# EAGLE design lamloei_breadout_a09201 (EAGLE 7.7.0)
CNAME: LamLoei breadout A07201; CREVISION: R1; DESIGNER: lamloei co.,ltd.
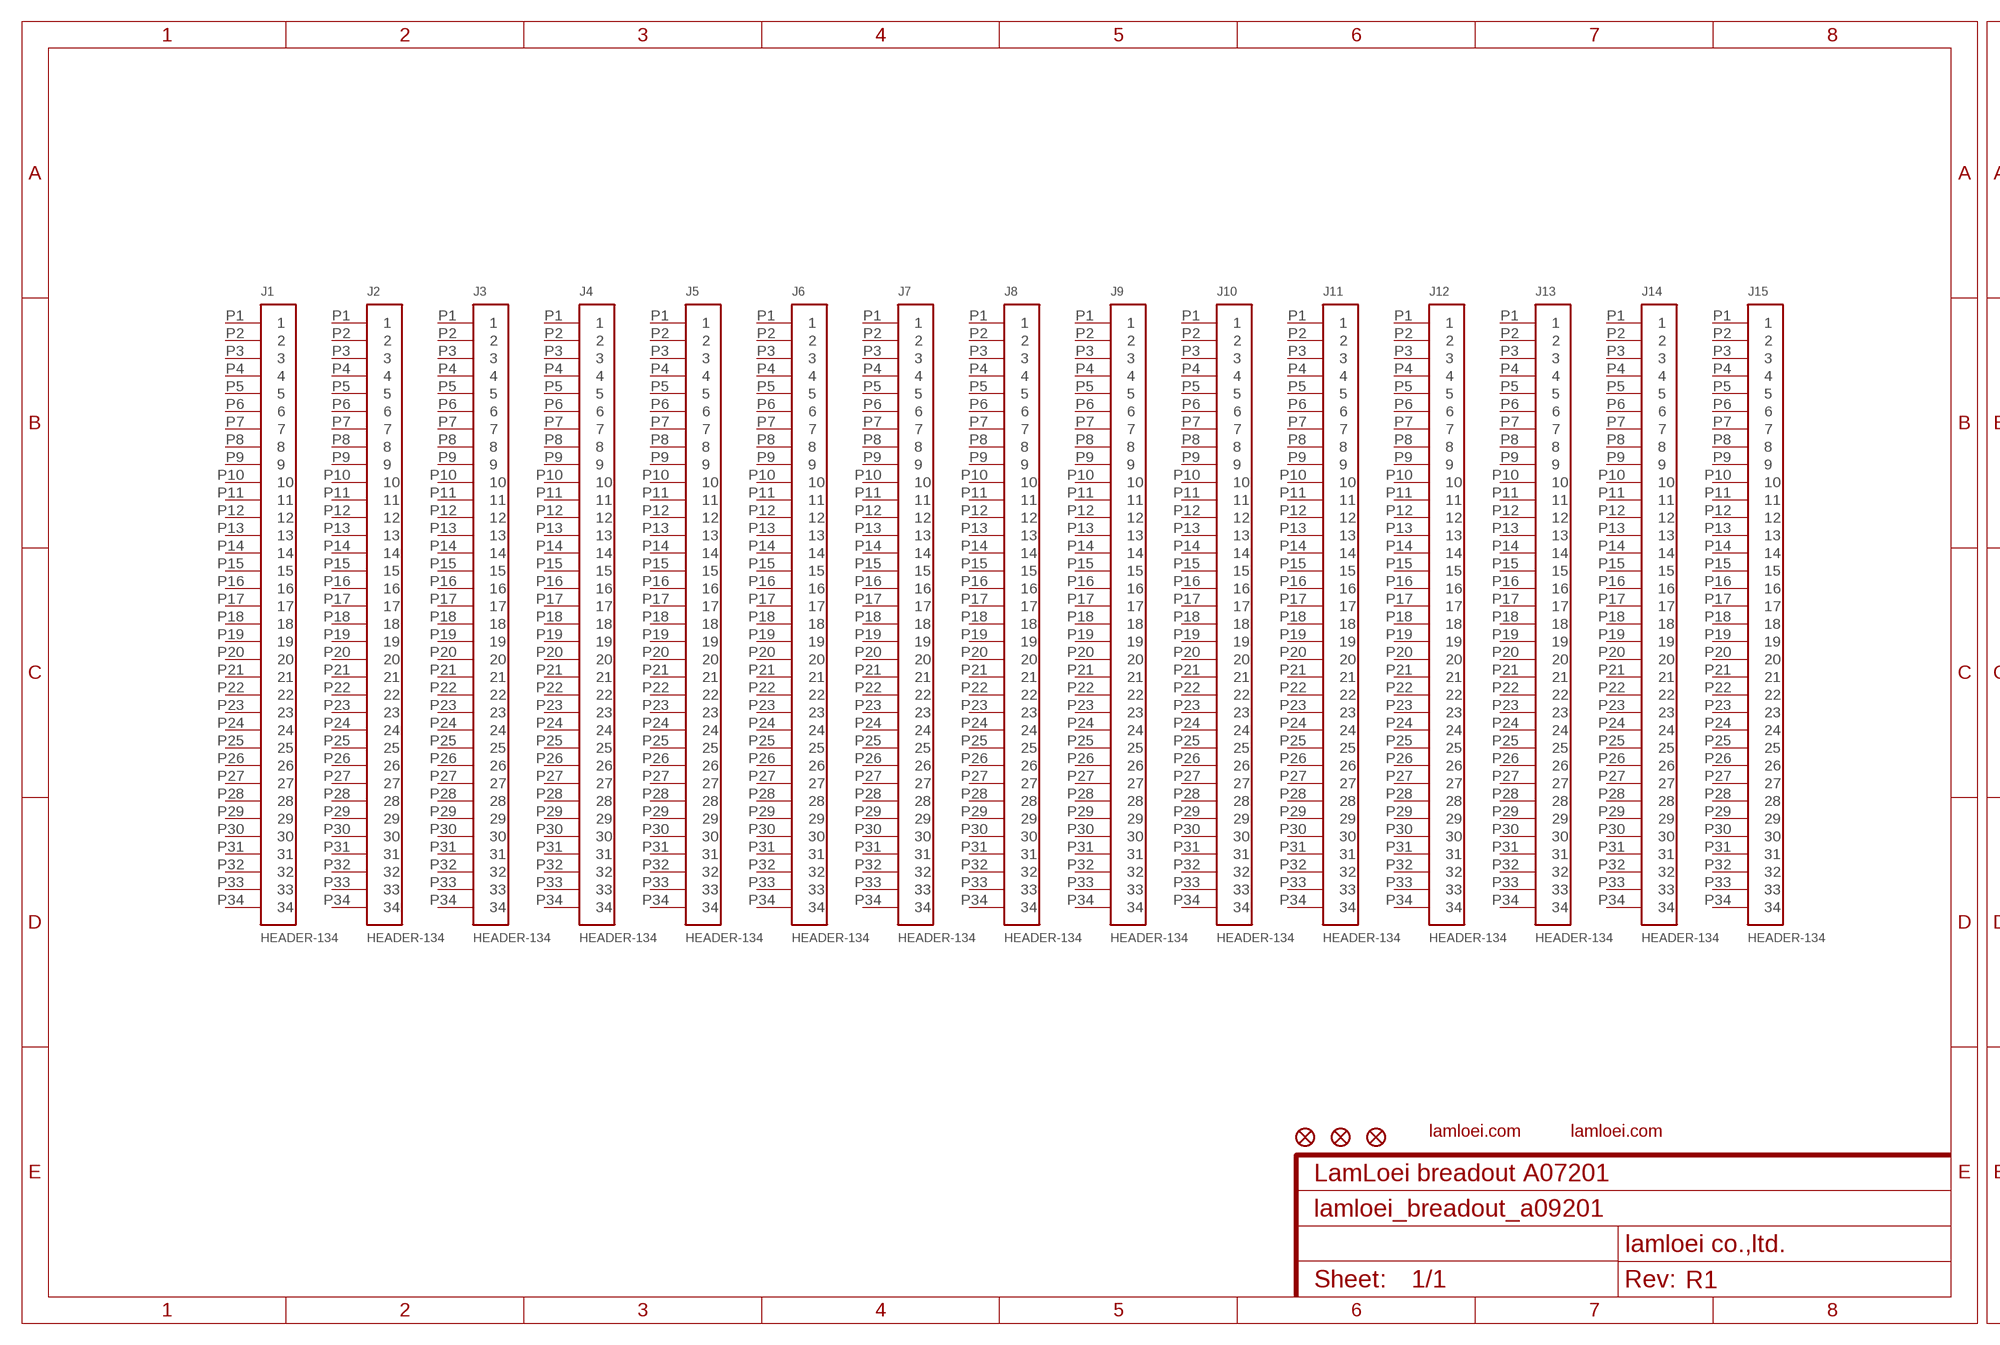
[diagram p0: schematic, sheet 1, part 1 of 2]
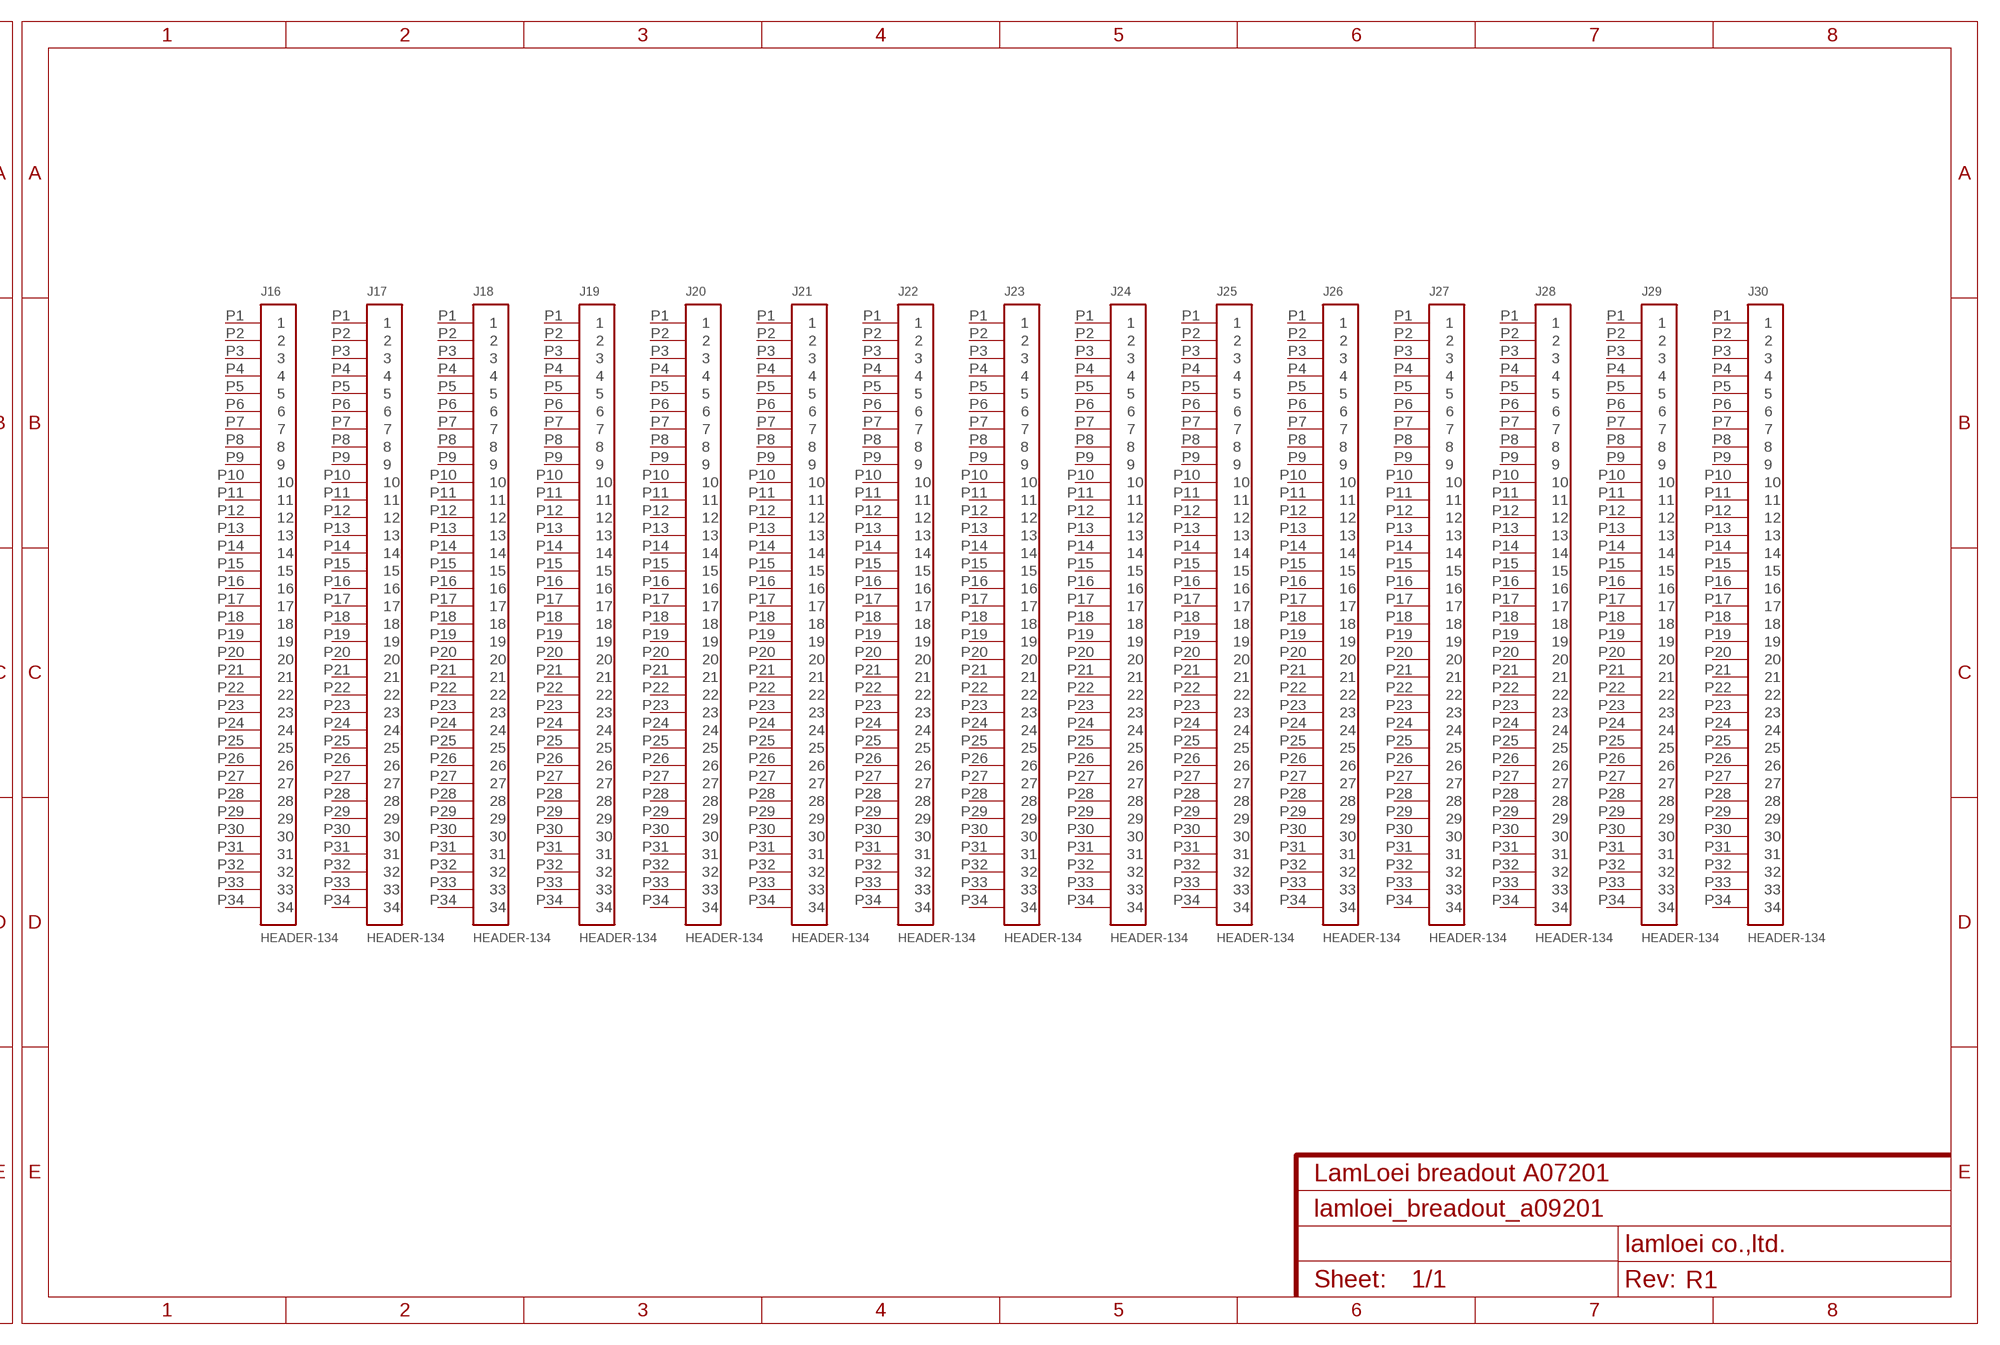
[diagram p1: schematic, sheet 1, part 2 of 2]

## Parts
J1  HEADER-134  [HEADER-134]
J2  HEADER-134  [HEADER-134]
J3  HEADER-134  [HEADER-134]
J4  HEADER-134  [HEADER-134]
J5  HEADER-134  [HEADER-134]
J6  HEADER-134  [HEADER-134]
J7  HEADER-134  [HEADER-134]
J8  HEADER-134  [HEADER-134]
J9  HEADER-134  [HEADER-134]
J10  HEADER-134  [HEADER-134]
J11  HEADER-134  [HEADER-134]
J12  HEADER-134  [HEADER-134]
J13  HEADER-134  [HEADER-134]
J14  HEADER-134  [HEADER-134]
J15  HEADER-134  [HEADER-134]
J16  HEADER-134  [HEADER-134]
J17  HEADER-134  [HEADER-134]
J18  HEADER-134  [HEADER-134]
J19  HEADER-134  [HEADER-134]
J20  HEADER-134  [HEADER-134]
J21  HEADER-134  [HEADER-134]
J22  HEADER-134  [HEADER-134]
J23  HEADER-134  [HEADER-134]
J24  HEADER-134  [HEADER-134]
J25  HEADER-134  [HEADER-134]
J26  HEADER-134  [HEADER-134]
J27  HEADER-134  [HEADER-134]
J28  HEADER-134  [HEADER-134]
J29  HEADER-134  [HEADER-134]
J30  HEADER-134  [HEADER-134]
ZFD1  FIDUCIAL1X2  [FIDUCIAL-1X2]
ZFD2  FIDUCIAL1X2  [FIDUCIAL-1X2]
ZFD3  FIDUCIAL1X2  [FIDUCIAL-1X2]
ZL1  LAMLEOI_LOGO_3  [LAMLEOI_LOGO_3]
ZL2  LAMLEOI_LOGO_3  [LAMLEOI_LOGO_3]
Unconnected: J1.P1 J1.P2 J1.P3 J1.P4 J1.P5 J1.P6 J1.P7 J1.P8 J1.P9 J1.P10 J1.P11 J1.P12 J1.P13 J1.P14 J1.P15 J1.P16 J1.P17 J1.P18 J1.P19 J1.P20 J1.P21 J1.P22 J1.P23 J1.P24 J1.P25 J1.P26 J1.P27 J1.P28 J1.P29 J1.P30 J1.P31 J1.P32 J1.P33 J1.P34 J2.P1 J2.P2 J2.P3 J2.P4 J2.P5 J2.P6 J2.P7 J2.P8 J2.P9 J2.P10 J2.P11 J2.P12 J2.P13 J2.P14 J2.P15 J2.P16 J2.P17 J2.P18 J2.P19 J2.P20 J2.P21 J2.P22 J2.P23 J2.P24 J2.P25 J2.P26 J2.P27 J2.P28 J2.P29 J2.P30 J2.P31 J2.P32 J2.P33 J2.P34 J3.P1 J3.P2 J3.P3 J3.P4 J3.P5 J3.P6 J3.P7 J3.P8 J3.P9 J3.P10 J3.P11 J3.P12 J3.P13 J3.P14 J3.P15 J3.P16 J3.P17 J3.P18 J3.P19 J3.P20 J3.P21 J3.P22 J3.P23 J3.P24 J3.P25 J3.P26 J3.P27 J3.P28 J3.P29 J3.P30 J3.P31 J3.P32 J3.P33 J3.P34 J4.P1 J4.P2 J4.P3 J4.P4 J4.P5 J4.P6 J4.P7 J4.P8 J4.P9 J4.P10 J4.P11 J4.P12 J4.P13 J4.P14 J4.P15 J4.P16 J4.P17 J4.P18 J4.P19 J4.P20 J4.P21 J4.P22 J4.P23 J4.P24 J4.P25 J4.P26 J4.P27 J4.P28 J4.P29 J4.P30 J4.P31 J4.P32 J4.P33 J4.P34 J5.P1 J5.P2 J5.P3 J5.P4 J5.P5 J5.P6 J5.P7 J5.P8 J5.P9 J5.P10 J5.P11 J5.P12 J5.P13 J5.P14 J5.P15 J5.P16 J5.P17 J5.P18 J5.P19 J5.P20 J5.P21 J5.P22 J5.P23 J5.P24 J5.P25 J5.P26 J5.P27 J5.P28 J5.P29 J5.P30 J5.P31 J5.P32 J5.P33 J5.P34 J6.P1 J6.P2 J6.P3 J6.P4 J6.P5 J6.P6 J6.P7 J6.P8 J6.P9 J6.P10 J6.P11 J6.P12 J6.P13 J6.P14 J6.P15 J6.P16 J6.P17 J6.P18 J6.P19 J6.P20 J6.P21 J6.P22 J6.P23 J6.P24 J6.P25 J6.P26 J6.P27 J6.P28 J6.P29 J6.P30 J6.P31 J6.P32 J6.P33 J6.P34 J7.P1 J7.P2 J7.P3 J7.P4 J7.P5 J7.P6 J7.P7 J7.P8 J7.P9 J7.P10 J7.P11 J7.P12 J7.P13 J7.P14 J7.P15 J7.P16 J7.P17 J7.P18 J7.P19 J7.P20 J7.P21 J7.P22 J7.P23 J7.P24 J7.P25 J7.P26 J7.P27 J7.P28 J7.P29 J7.P30 J7.P31 J7.P32 J7.P33 J7.P34 J8.P1 J8.P2 J8.P3 J8.P4 J8.P5 J8.P6 J8.P7 J8.P8 J8.P9 J8.P10 J8.P11 J8.P12 J8.P13 J8.P14 J8.P15 J8.P16 J8.P17 J8.P18 J8.P19 J8.P20 J8.P21 J8.P22 J8.P23 J8.P24 J8.P25 J8.P26 J8.P27 J8.P28 J8.P29 J8.P30 J8.P31 J8.P32 J8.P33 J8.P34 J9.P1 J9.P2 J9.P3 J9.P4 J9.P5 J9.P6 J9.P7 J9.P8 J9.P9 J9.P10 J9.P11 J9.P12 J9.P13 J9.P14 J9.P15 J9.P16 J9.P17 J9.P18 J9.P19 J9.P20 J9.P21 J9.P22 J9.P23 J9.P24 J9.P25 J9.P26 J9.P27 J9.P28 J9.P29 J9.P30 J9.P31 J9.P32 J9.P33 J9.P34 J10.P1 J10.P2 J10.P3 J10.P4 J10.P5 J10.P6 J10.P7 J10.P8 J10.P9 J10.P10 J10.P11 J10.P12 J10.P13 J10.P14 J10.P15 J10.P16 J10.P17 J10.P18 J10.P19 J10.P20 J10.P21 J10.P22 J10.P23 J10.P24 J10.P25 J10.P26 J10.P27 J10.P28 J10.P29 J10.P30 J10.P31 J10.P32 J10.P33 J10.P34 J11.P1 J11.P2 J11.P3 J11.P4 J11.P5 J11.P6 J11.P7 J11.P8 J11.P9 J11.P10 J11.P11 J11.P12 J11.P13 J11.P14 J11.P15 J11.P16 J11.P17 J11.P18 J11.P19 J11.P20 J11.P21 J11.P22 J11.P23 J11.P24 J11.P25 J11.P26 J11.P27 J11.P28 J11.P29 J11.P30 J11.P31 J11.P32 J11.P33 J11.P34 J12.P1 J12.P2 J12.P3 J12.P4 J12.P5 J12.P6 J12.P7 J12.P8 J12.P9 J12.P10 J12.P11 J12.P12 J12.P13 J12.P14 J12.P15 J12.P16 J12.P17 J12.P18 J12.P19 J12.P20 J12.P21 J12.P22 J12.P23 J12.P24 J12.P25 J12.P26 J12.P27 J12.P28 J12.P29 J12.P30 J12.P31 J12.P32 J12.P33 J12.P34 J13.P1 J13.P2 J13.P3 J13.P4 J13.P5 J13.P6 J13.P7 J13.P8 J13.P9 J13.P10 J13.P11 J13.P12 J13.P13 J13.P14 J13.P15 J13.P16 J13.P17 J13.P18 J13.P19 J13.P20 J13.P21 J13.P22 J13.P23 J13.P24 J13.P25 J13.P26 J13.P27 J13.P28 J13.P29 J13.P30 J13.P31 J13.P32 J13.P33 J13.P34 J14.P1 J14.P2 J14.P3 J14.P4 J14.P5 J14.P6 J14.P7 J14.P8 J14.P9 J14.P10 J14.P11 J14.P12 J14.P13 J14.P14 J14.P15 J14.P16 J14.P17 J14.P18 J14.P19 J14.P20 J14.P21 J14.P22 J14.P23 J14.P24 J14.P25 J14.P26 J14.P27 J14.P28 J14.P29 J14.P30 J14.P31 J14.P32 J14.P33 J14.P34 J15.P1 J15.P2 J15.P3 J15.P4 J15.P5 J15.P6 J15.P7 J15.P8 J15.P9 J15.P10 J15.P11 J15.P12 J15.P13 J15.P14 J15.P15 J15.P16 J15.P17 J15.P18 J15.P19 J15.P20 J15.P21 J15.P22 J15.P23 J15.P24 J15.P25 J15.P26 J15.P27 J15.P28 J15.P29 J15.P30 J15.P31 J15.P32 J15.P33 J15.P34 J16.P1 J16.P2 J16.P3 J16.P4 J16.P5 J16.P6 J16.P7 J16.P8 J16.P9 J16.P10 J16.P11 J16.P12 J16.P13 J16.P14 J16.P15 J16.P16 J16.P17 J16.P18 J16.P19 J16.P20 J16.P21 J16.P22 J16.P23 J16.P24 J16.P25 J16.P26 J16.P27 J16.P28 J16.P29 J16.P30 J16.P31 J16.P32 J16.P33 J16.P34 J17.P1 J17.P2 J17.P3 J17.P4 J17.P5 J17.P6 J17.P7 J17.P8 J17.P9 J17.P10 J17.P11 J17.P12 J17.P13 J17.P14 J17.P15 J17.P16 J17.P17 J17.P18 J17.P19 J17.P20 J17.P21 J17.P22 J17.P23 J17.P24 J17.P25 J17.P26 J17.P27 J17.P28 J17.P29 J17.P30 J17.P31 J17.P32 J17.P33 J17.P34 J18.P1 J18.P2 J18.P3 J18.P4 J18.P5 J18.P6 J18.P7 J18.P8 J18.P9 J18.P10 J18.P11 J18.P12 J18.P13 J18.P14 J18.P15 J18.P16 J18.P17 J18.P18 J18.P19 J18.P20 J18.P21 J18.P22 J18.P23 J18.P24 J18.P25 J18.P26 J18.P27 J18.P28 J18.P29 J18.P30 J18.P31 J18.P32 J18.P33 J18.P34 J19.P1 J19.P2 J19.P3 J19.P4 J19.P5 J19.P6 J19.P7 J19.P8 J19.P9 J19.P10 J19.P11 J19.P12 J19.P13 J19.P14 J19.P15 J19.P16 J19.P17 J19.P18 J19.P19 J19.P20 J19.P21 J19.P22 J19.P23 J19.P24 J19.P25 J19.P26 J19.P27 J19.P28 J19.P29 J19.P30 J19.P31 J19.P32 J19.P33 J19.P34 J20.P1 J20.P2 J20.P3 J20.P4 J20.P5 J20.P6 J20.P7 J20.P8 J20.P9 J20.P10 J20.P11 J20.P12 J20.P13 J20.P14 J20.P15 J20.P16 J20.P17 J20.P18 J20.P19 J20.P20 J20.P21 J20.P22 J20.P23 J20.P24 J20.P25 J20.P26 J20.P27 J20.P28 J20.P29 J20.P30 J20.P31 J20.P32 J20.P33 J20.P34 J21.P1 J21.P2 J21.P3 J21.P4 J21.P5 J21.P6 J21.P7 J21.P8 J21.P9 J21.P10 J21.P11 J21.P12 J21.P13 J21.P14 J21.P15 J21.P16 J21.P17 J21.P18 J21.P19 J21.P20 J21.P21 J21.P22 J21.P23 J21.P24 J21.P25 J21.P26 J21.P27 J21.P28 J21.P29 J21.P30 J21.P31 J21.P32 J21.P33 J21.P34 J22.P1 J22.P2 J22.P3 J22.P4 J22.P5 J22.P6 J22.P7 J22.P8 J22.P9 J22.P10 J22.P11 J22.P12 J22.P13 J22.P14 J22.P15 J22.P16 J22.P17 J22.P18 J22.P19 J22.P20 J22.P21 J22.P22 J22.P23 J22.P24 J22.P25 J22.P26 J22.P27 J22.P28 J22.P29 J22.P30 J22.P31 J22.P32 J22.P33 J22.P34 J23.P1 J23.P2 J23.P3 J23.P4 J23.P5 J23.P6 J23.P7 J23.P8 J23.P9 J23.P10 J23.P11 J23.P12 J23.P13 J23.P14 J23.P15 J23.P16 J23.P17 J23.P18 J23.P19 J23.P20 J23.P21 J23.P22 J23.P23 J23.P24 J23.P25 J23.P26 J23.P27 J23.P28 J23.P29 J23.P30 J23.P31 J23.P32 J23.P33 J23.P34 J24.P1 J24.P2 J24.P3 J24.P4 J24.P5 J24.P6 J24.P7 J24.P8 J24.P9 J24.P10 J24.P11 J24.P12 J24.P13 J24.P14 J24.P15 J24.P16 J24.P17 J24.P18 J24.P19 J24.P20 J24.P21 J24.P22 J24.P23 J24.P24 J24.P25 J24.P26 J24.P27 J24.P28 J24.P29 J24.P30 J24.P31 J24.P32 J24.P33 J24.P34 J25.P1 J25.P2 J25.P3 J25.P4 J25.P5 J25.P6 J25.P7 J25.P8 J25.P9 J25.P10 J25.P11 J25.P12 J25.P13 J25.P14 J25.P15 J25.P16 J25.P17 J25.P18 J25.P19 J25.P20 J25.P21 J25.P22 J25.P23 J25.P24 J25.P25 J25.P26 J25.P27 J25.P28 J25.P29 J25.P30 J25.P31 J25.P32 J25.P33 J25.P34 J26.P1 J26.P2 J26.P3 J26.P4 J26.P5 J26.P6 J26.P7 J26.P8 J26.P9 J26.P10 J26.P11 J26.P12 J26.P13 J26.P14 J26.P15 J26.P16 J26.P17 J26.P18 J26.P19 J26.P20 J26.P21 J26.P22 J26.P23 J26.P24 J26.P25 J26.P26 J26.P27 J26.P28 J26.P29 J26.P30 J26.P31 J26.P32 J26.P33 J26.P34 J27.P1 J27.P2 J27.P3 J27.P4 J27.P5 J27.P6 J27.P7 J27.P8 J27.P9 J27.P10 J27.P11 J27.P12 J27.P13 J27.P14 J27.P15 J27.P16 J27.P17 J27.P18 J27.P19 J27.P20 J27.P21 J27.P22 J27.P23 J27.P24 J27.P25 J27.P26 J27.P27 J27.P28 J27.P29 J27.P30 J27.P31 J27.P32 J27.P33 J27.P34 J28.P1 J28.P2 J28.P3 J28.P4 J28.P5 J28.P6 J28.P7 J28.P8 J28.P9 J28.P10 J28.P11 J28.P12 J28.P13 J28.P14 J28.P15 J28.P16 J28.P17 J28.P18 J28.P19 J28.P20 J28.P21 J28.P22 J28.P23 J28.P24 J28.P25 J28.P26 J28.P27 J28.P28 J28.P29 J28.P30 J28.P31 J28.P32 J28.P33 J28.P34 J29.P1 J29.P2 J29.P3 J29.P4 J29.P5 J29.P6 J29.P7 J29.P8 J29.P9 J29.P10 J29.P11 J29.P12 J29.P13 J29.P14 J29.P15 J29.P16 J29.P17 J29.P18 J29.P19 J29.P20 J29.P21 J29.P22 J29.P23 J29.P24 J29.P25 J29.P26 J29.P27 J29.P28 J29.P29 J29.P30 J29.P31 J29.P32 J29.P33 J29.P34 J30.P1 J30.P2 J30.P3 J30.P4 J30.P5 J30.P6 J30.P7 J30.P8 J30.P9 J30.P10 J30.P11 J30.P12 J30.P13 J30.P14 J30.P15 J30.P16 J30.P17 J30.P18 J30.P19 J30.P20 J30.P21 J30.P22 J30.P23 J30.P24 J30.P25 J30.P26 J30.P27 J30.P28 J30.P29 J30.P30 J30.P31 J30.P32 J30.P33 J30.P34

## Library data of the parts
J1-J30 = lamloei_e77_HEADER-134B:HEADER-134
ZFD1-ZFD3 = SparkFun-Aesthetics:FIDUCIAL: Fiducial Alignment Points Point-of-reference for pick-and-place machines and other optical instruments.
ZL1 ZL2 = lamloei_logo_3:LAMLEOI_LOGO_3: lamloei

## Board
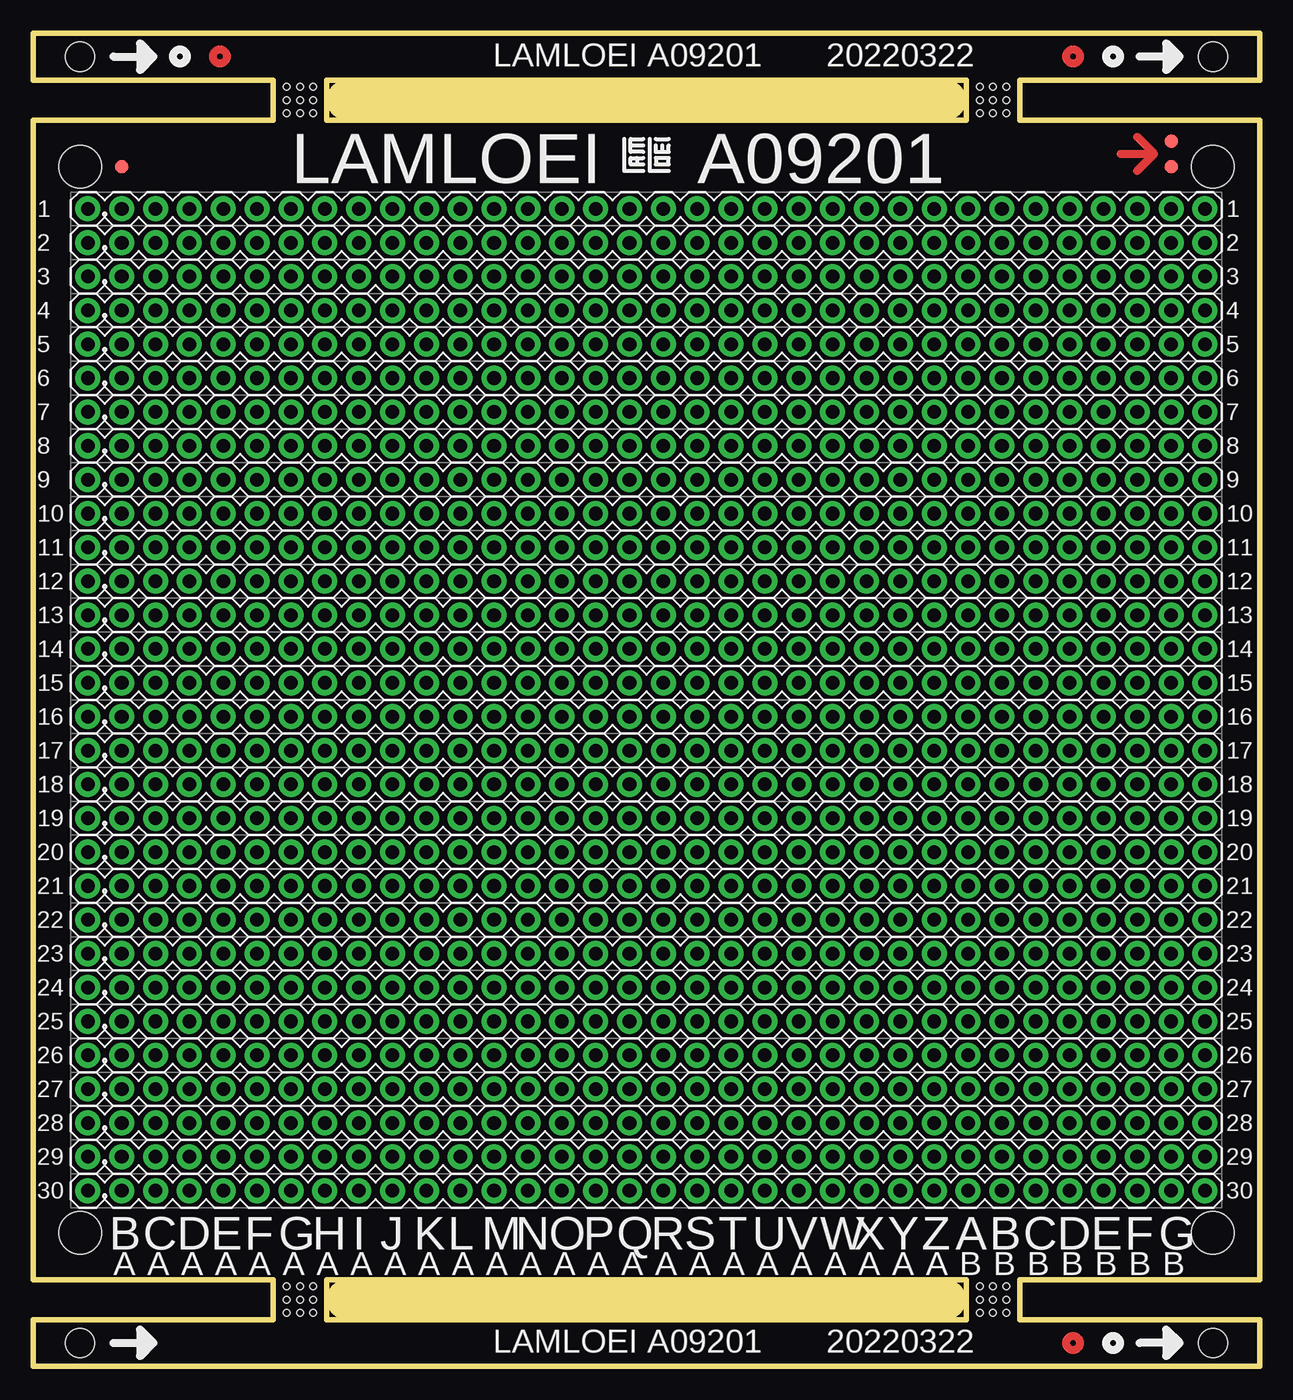
[diagram p2: board, top side]
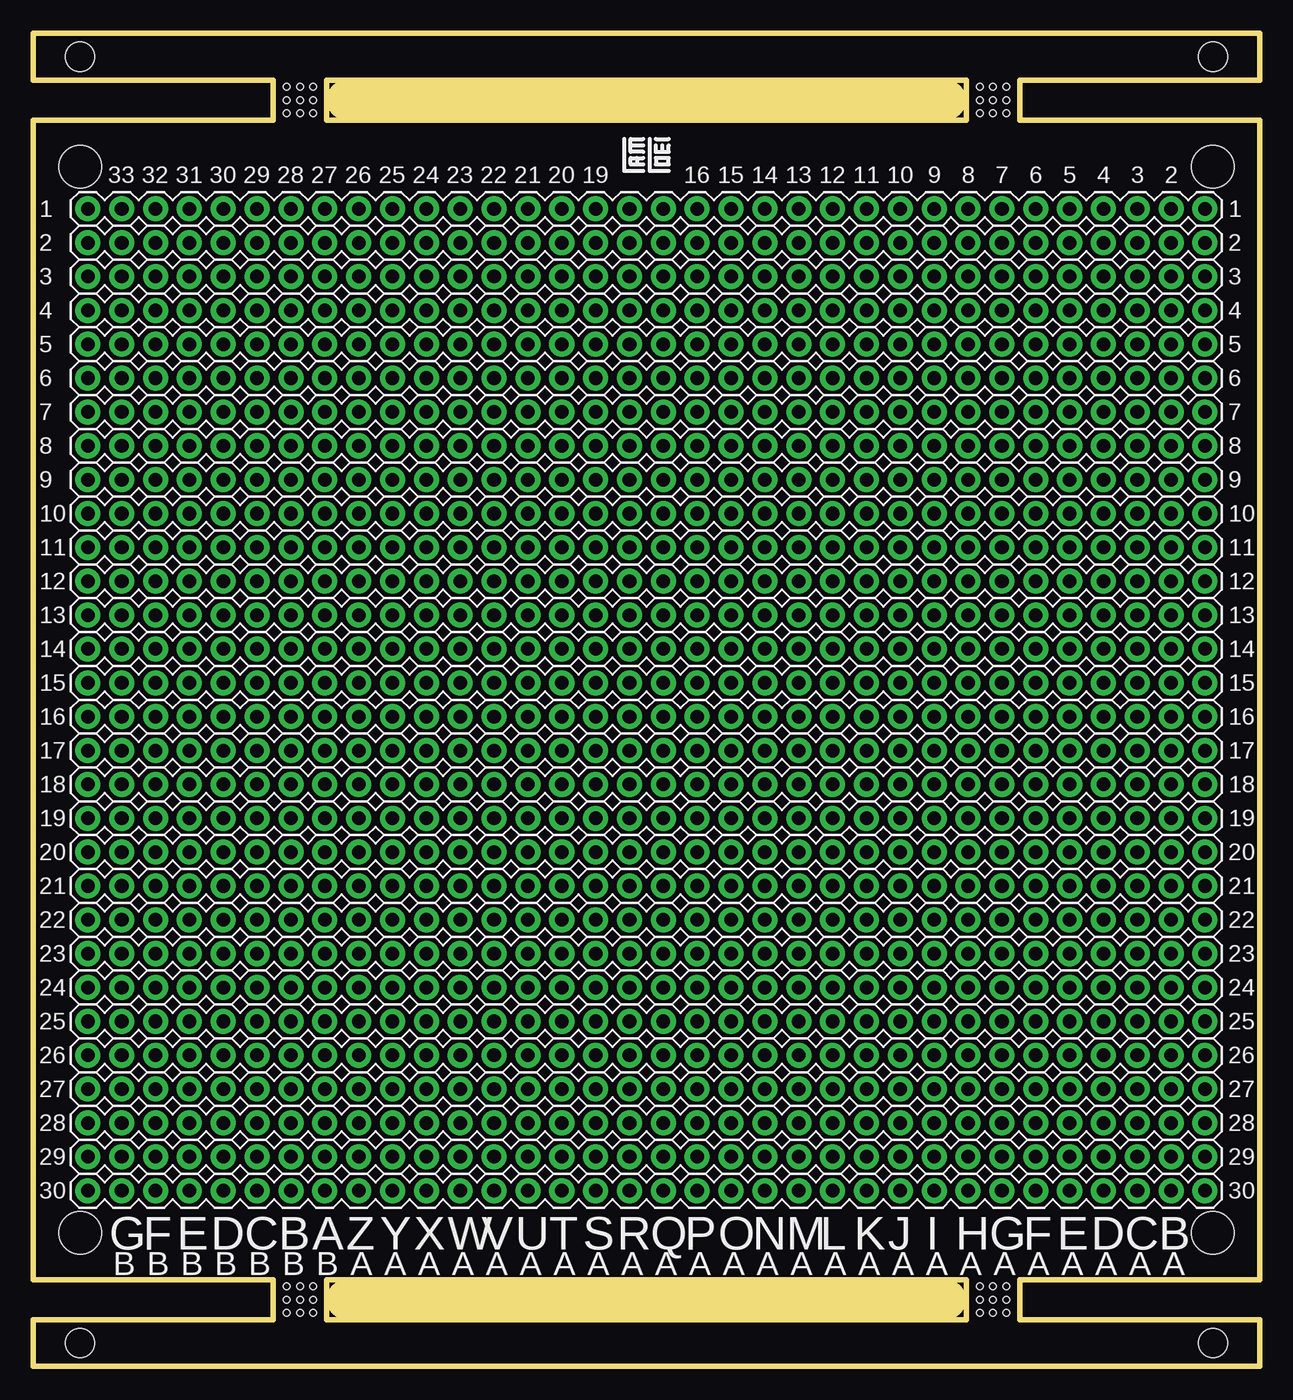
[diagram p3: board, bottom side, seen from below]

Size 92 x 100 mm. Coordinates in mm from the lower left corner, seen from the top.
Outline: 0,93.5 18,93.5 18,96.5 0,96.5 0,100 92,100 92,96.5 74,96.5 74,93.5 92,93.5 92,6.5 74,6.5 74,3.5 92,3.5 92,0 0,0 0,3.5 18,3.5 18,6.5 0,6.5 0,93.5
Outline: 22,93.5 70,93.5 70,96.5 22,96.5 22,93.5
Outline: 70,6.5 22,6.5 22,3.5 70,3.5 70,6.5
Copper layers (1*16): Top 0.035mm / dielectric 0.2mm / Bottom 0.035mm
Design rules "jlcpcb-2-layer": minimum track width 3.5mil, minimum drill 0.2mm, track to track 3.5mil, track to pad 5mil, pad to pad 5mil, via to via 5mil, smd to smd 0mil, copper to edge 0.1mm, drill to drill 5mil, minimum pad ring 4mil, minimum via ring 4mil, stop-mask expansion 3mil, vias tented up to drill 100mil, thermal gap 10mil
Holes 3.2 mm at 3.5,10 88.5,10 3.5,90 88.5,90
Holes 0.5 mm at 20,94 21,94 19,94 19,95 19,96 20,96 20,95 21,95 21,96 72,94 71,94 71,95 71,96 72,96 72,95 73,95 73,94 73,96 20,6 19,6 19,5 19,4 20,4 20,5 21,6 21,5 21,4 72,6 71,6 71,5 71,4 72,5 72,4 73,4 73,5 73,6
Holes 2.2 mm at 3.5,1.75 88.5,1.75 3.5,98.25 88.5,98.25
Milling: 2 lines

### Footprints (pad centres in the part's own frame; a part is rotated, then mirrored left to right if it is on the bottom)
HEADER-134 = drill 1.016 pad 1.88: P1 41.91,0; P2 39.37,0; P3 36.83,0; P4 34.29,0; P5 31.75,0; P6 29.21,0; P7 26.67,0; P8 24.13,0; P9 21.59,0; P10 19.05,0; P11 16.51,0; P12 13.97,0; P13 11.43,0; P14 8.89,0; P15 6.35,0; P16 3.81,0; P17 1.27,0; P18 -1.27,0; P19 -3.81,0; P20 -6.35,0; P21 -8.89,0; P22 -11.43,0; P23 -13.97,0; P24 -16.51,0; P25 -19.05,0; P26 -21.59,0; P27 -24.13,0; P28 -26.67,0; P29 -29.21,0; P30 -31.75,0; P31 -34.29,0; P32 -36.83,0; P33 -39.37,0; P34 -41.91,0
FIDUCIAL-1X2 = smd 1 x 1: 1 0,0

### Placement (x,y rotation side)
J1  46,86.83 180 top
J2  46,84.29 180 top
J3  46,81.75 180 top
J4  46,79.21 180 top
J5  46,76.67 180 top
J6  46,74.13 180 top
J7  46,71.59 180 top
J8  46,69.05 180 top
J9  46,66.51 180 top
J10  46,63.97 180 top
J11  46,61.43 180 top
J12  46,58.89 180 top
J13  46,56.35 180 top
J14  46,53.81 180 top
J15  46,51.27 180 top
J16  46,48.73 180 top
J17  46,46.19 180 top
J18  46,43.65 180 top
J19  46,41.11 180 top
J20  46,38.57 180 top
J21  46,36.03 180 top
J22  46,33.49 180 top
J23  46,30.95 180 top
J24  46,28.41 180 top
J25  46,25.87 180 top
J26  46,23.33 180 top
J27  46,20.79 180 top
J28  46,18.25 180 top
J29  46,15.71 180 top
J30  46,13.17 180 top
ZFD1  6.63,90 0 top
ZFD2  85.37,91.91 0 top
ZFD3  85.37,90 0 top
ZL1  44.02,89.37 0 top
ZL2  47.98,89.37 0 bottom

### Tracks (layer width: path | path; a pad name or v marks a point on that pad's centre or on a via)
N$1
  Top 0.61: 81.56,90.96 84.1,90.96 | 84.1,90.96 82.83,92.23 | 82.83,89.69 84.1,90.96
(copper drawn outside any net)
  shapes: Top circle x3

### Text on the board
tNames: LAMLOEI A09201 | 20220322 | LAMLOEI | A09201 | 1 | 1 | 2 | 2 | 3 | 3 | 4 | 4 | 5 | 5 | 6 | 6 | 7 | 7 | 8 | 8 | 9 | 9 | 10 | 10 | 11 | 11 | 12 | 12 | 13 | 13 | 14 | 14 | 15 | 15 | 16 | 16 | 17 | 17 | 18 | 18 | 19 | 19 | 20 | 20 | 21 | 21 | 22 | 22 | 23 | 23 | 24 | 24 | 25 | 25 | 26 | 26 | 27 | 27 | 28 | 28 | 29 | 29 | 30 | 30 | B | C | D | E | F | G | H | I | J | K | L | M | N | O | P | Q | R | S | T | U | V | W | X | Y | Z | A | B | C | D | E | F | G | A | A | A | A | A | A | A | A | A | A | A | A | A | A | A | A | A | A | A | A | A | A | A | A | A | B | B | B | B | B | B | B | LAMLOEI A09201 | 20220322
bNames: 2 | 3 | 4 | 5 | 6 | 7 | 8 | 9 | 10 | 11 | 12 | 13 | 14 | 15 | 16 | 19 | 20 | 21 | 22 | 23 | 24 | 25 | 26 | 27 | 28 | 29 | 30 | 31 | 32 | 33 | 1 | 1 | 2 | 2 | 3 | 3 | 4 | 4 | 5 | 5 | 6 | 6 | 7 | 7 | 8 | 8 | 9 | 9 | 10 | 10 | 11 | 11 | 12 | 12 | 13 | 13 | 14 | 14 | 15 | 15 | 16 | 16 | 17 | 17 | 18 | 18 | 19 | 19 | 20 | 20 | 21 | 21 | 22 | 22 | 23 | 23 | 24 | 24 | 25 | 25 | 26 | 26 | 27 | 27 | 28 | 28 | 29 | 29 | 30 | 30 | B | C | D | E | F | G | H | I | J | K | L | M | N | O | P | Q | R | S | T | U | V | W | X | Y | Z | A | B | C | D | E | F | G | A | A | A | A | A | A | A | A | A | A | A | A | A | A | A | A | A | A | A | A | A | A | A | A | A | B | B | B | B | B | B | B